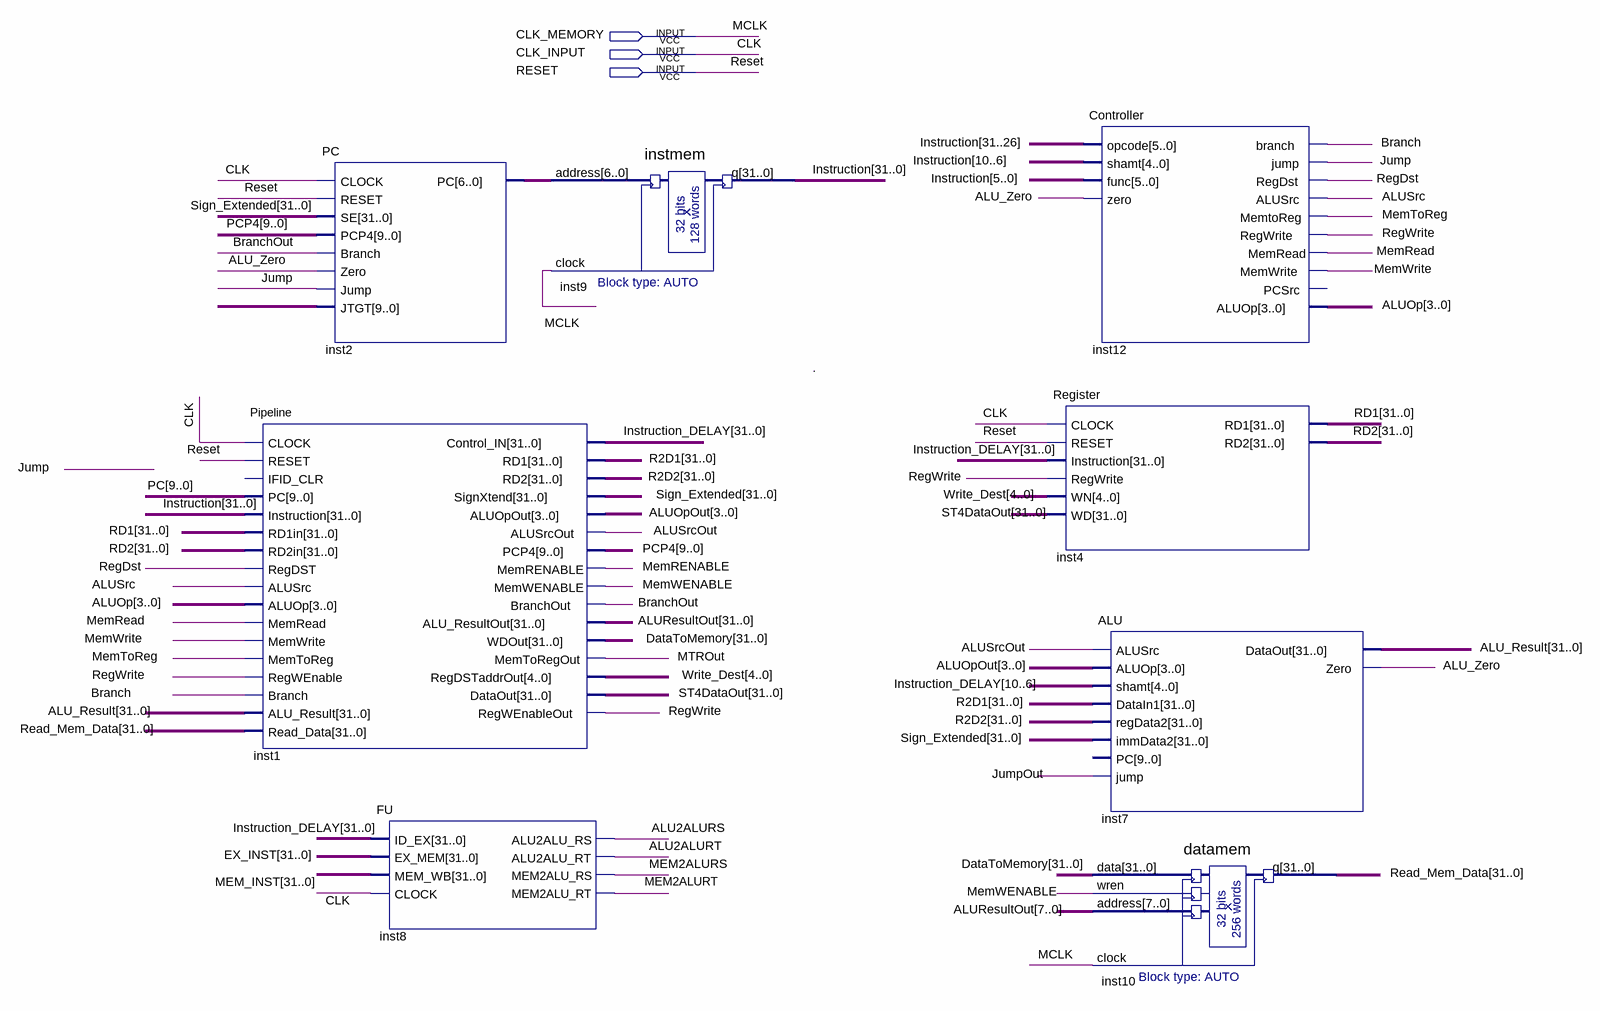
[diagram p0: schematic sheet]
// Quartus schematic MIPS.bdf as structural Verilog: 8 symbols, 3 pins
module MIPS (
  input  CLK_MEMORY,
  input  CLK_INPUT,
  input  RESET
);

  wire ALU2ALURS, ALU2ALURT, ALU_Zero, ALUSrc, ALUSrcOut, Branch, BranchOut, Jump, JumpOut, MEM2ALURS,
       MEM2ALURT, MemRead, MemRENABLE, MemToReg, MemWENABLE, MemWrite, MTROut, RegDst, RegWrite;
  wire [3:0] ALUOp, ALUOpOut;
  wire [4:0] Write_Dest;
  wire [6:0] inst2_pc;
  wire [9:0] PC, PCP4, undriven;
  wire [31:0] ALU_Result, ALUResultOut, DataToMemory, EX_INST, Instruction, Instruction_DELAY, MEM_INST,
       R2D1, R2D2, RD1, RD2, Read_Mem_Data, Sign_Extended, ST4DataOut;

  Pipeline inst1 (
    .CLOCK(CLK_INPUT), .RESET(RESET), .PC(PC), .Instruction(Instruction), .RD1in(RD1), .RD2in(RD2),
    .RegDST(RegDst), .ALUSrc(ALUSrc), .ALUOp(ALUOp), .MemRead(MemRead), .MemWrite(MemWrite),
    .MemToReg(MemToReg), .RegWEnable(RegWrite), .Branch(Branch), .ALU_Result(ALU_Result),
    .Read_Data(Read_Mem_Data), .Control_IN(Instruction_DELAY), .RD1(R2D1), .RD2(R2D2),
    .SignXtend(Sign_Extended), .ALUOpOut(ALUOpOut), .ALUSrcOut(ALUSrcOut), .PCP4(PCP4),
    .MemRENABLE(MemRENABLE), .MemWENABLE(MemWENABLE), .BranchOut(BranchOut), .ALU_ResultOut(ALUResultOut),
    .WDOut(DataToMemory), .MemToRegOut(MTROut), .RegDSTaddrOut(Write_Dest), .DataOut(ST4DataOut),
    .RegWEnableOut(RegWrite));  // open: IFID_CLR
  PC inst2 (
    .CLOCK(CLK_INPUT), .RESET(RESET), .SE(Sign_Extended), .PCP4(PCP4), .Branch(BranchOut), .Zero(ALU_Zero),
    .Jump(Jump), .JTGT(undriven), .PC(inst2_pc));
  FU inst8 (
    .ID_EX(Instruction_DELAY), .EX_MEM(EX_INST), .MEM_WB(MEM_INST), .CLOCK(CLK_INPUT),
    .ALU2ALU_RS(ALU2ALURS), .ALU2ALU_RT(ALU2ALURT), .MEM2ALU_RS(MEM2ALURS), .MEM2ALU_RT(MEM2ALURT));
  instmem inst9 (.address(inst2_pc), .clock(CLK_MEMORY), .q(Instruction));
  Controller inst12 (
    .opcode(Instruction[31:26]), .shamt(Instruction[10:6]), .func(Instruction[5:0]), .zero(ALU_Zero),
    .branch(Branch), .jump(Jump), .RegDst(RegDst), .ALUSrc(ALUSrc), .MemtoReg(MemToReg), .RegWrite(RegWrite),
    .MemRead(MemRead), .MemWrite(MemWrite), .ALUOp(ALUOp));  // open: PCSrc
  Register inst4 (
    .CLOCK(CLK_INPUT), .RESET(RESET), .Instruction(Instruction_DELAY), .RegWrite(RegWrite), .WN(Write_Dest),
    .WD(ST4DataOut), .RD1(RD1), .RD2(RD2));
  ALU inst7 (
    .ALUSrc(ALUSrcOut), .ALUOp(ALUOpOut), .shamt(Instruction_DELAY[10:6]), .DataIn1(R2D1), .regData2(R2D2),
    .immData2(Sign_Extended), .jump(JumpOut), .DataOut(ALU_Result), .Zero(ALU_Zero));  // open: PC
  datamem inst10 (
    .data(DataToMemory), .wren(MemWENABLE), .address(ALUResultOut[7:0]), .clock(CLK_MEMORY), .q(Read_Mem_Data));

  // Other names for the same wires on the sheet: CLK = CLK_INPUT; MCLK = CLK_MEMORY

  // Notes on the sheet:
  //   .
endmodule
